# EAGLE design Syno_Ver1.1 (EAGLE 9.5.2)
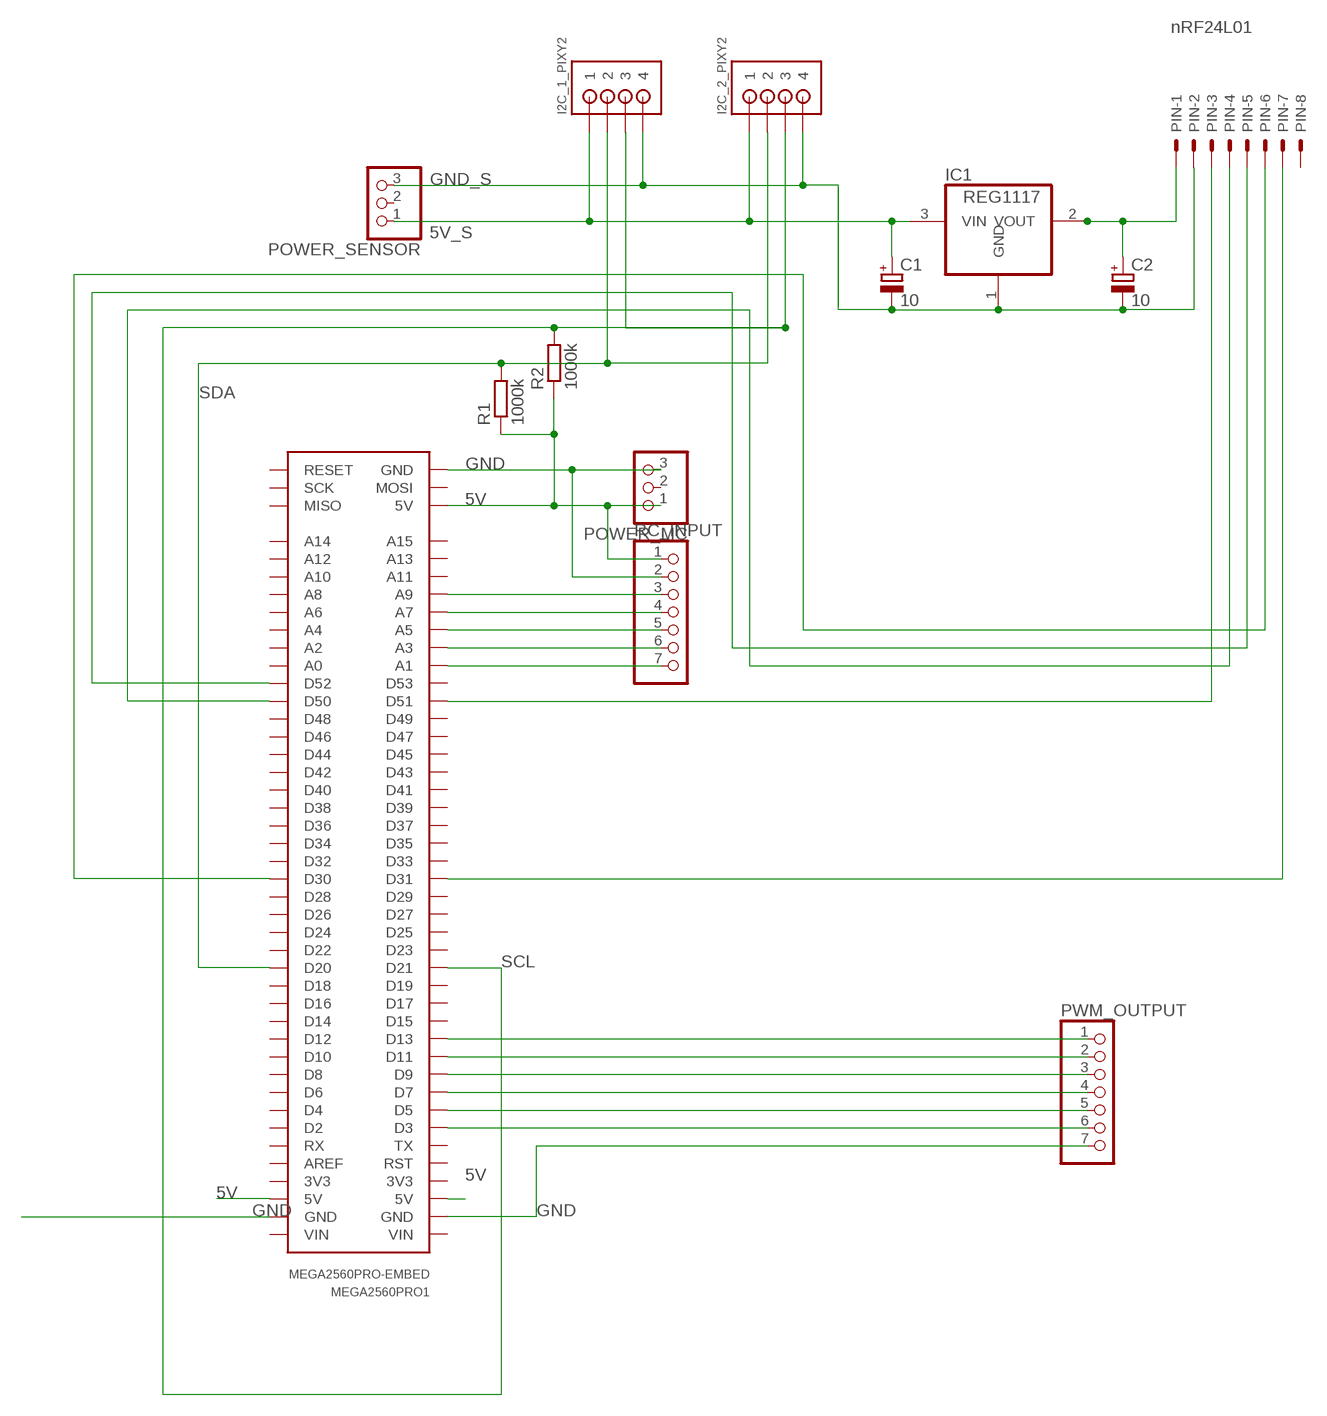
[diagram p0: schematic, sheet 1]

## Parts
C1  10  CPOL-EUE1.8-4  [E1,8-4]
C2  10  CPOL-EUE1.8-4  [E1,8-4]
I2C_1_PIXY2  JST-PH_4-PIN_HEADER  [JST_B4B-PH_HEADER]
I2C_2_PIXY2  JST-PH_4-PIN_HEADER  [JST_B4B-PH_HEADER]
IC1  REG1117  [SOT223]
MEGA2560PRO1  MEGA2560PRO-EMBED  [MEGA2560PRO-EMBED]
PIN  nRF24L01  JST-XH-08-PIN-ROUND-PAD  [JST-XH-08-PACKAGE-ROUND-PAD]
POWER_MC  PINHD-1X3/90  [1X03/90]
POWER_SENSOR  PINHD-1X3/90  [1X03/90]
PWM_OUTPUT  PINHD-1X7/90  [1X07/90]
R1  1000k  R-EU_0204/5  [0204/5]
R2  1000k  R-EU_0204/5  [0204/5]
RC_INPUT  PINHD-1X7/90  [1X07/90]

## Nets
5V: MEGA2560PRO1.5V@1(5V) MEGA2560PRO1.5V@2(5V) MEGA2560PRO1.5V@3(5V) POWER_MC.1 R1.1 R2.1 RC_INPUT.1
5V_S: C1.+ I2C_1_PIXY2.P1 I2C_2_PIXY2.P1 IC1.3(VIN) POWER_SENSOR.1
GND: MEGA2560PRO1.GND@1(GND) MEGA2560PRO1.GND@2(GND) MEGA2560PRO1.GND@3(GND) POWER_MC.3 PWM_OUTPUT.7 RC_INPUT.2
GND_S: C1.- C2.- I2C_1_PIXY2.P4 I2C_2_PIXY2.P4 IC1.1(GND) PIN.2 POWER_SENSOR.3
N$1: MEGA2560PRO1.D51 PIN.3
N$2: C2.+ IC1.2(VOUT) PIN.1
N$3: MEGA2560PRO1.D50 PIN.4
N$4: MEGA2560PRO1.D52 PIN.5
N$5: MEGA2560PRO1.D30 PIN.6
N$6: MEGA2560PRO1.D31 PIN.7
N$7: MEGA2560PRO1.D13 PWM_OUTPUT.1
N$8: MEGA2560PRO1.D11 PWM_OUTPUT.2
N$9: MEGA2560PRO1.D9 PWM_OUTPUT.3
N$10: MEGA2560PRO1.D7 PWM_OUTPUT.4
N$11: MEGA2560PRO1.D5 PWM_OUTPUT.5
N$12: MEGA2560PRO1.D3 PWM_OUTPUT.6
N$13: MEGA2560PRO1.A9 RC_INPUT.3
N$14: MEGA2560PRO1.A7 RC_INPUT.4
N$15: MEGA2560PRO1.A5 RC_INPUT.5
N$16: MEGA2560PRO1.A3 RC_INPUT.6
N$17: MEGA2560PRO1.A1 RC_INPUT.7
SCL: I2C_1_PIXY2.P3 I2C_2_PIXY2.P3 MEGA2560PRO1.D21 R2.2
SDA: I2C_1_PIXY2.P2 I2C_2_PIXY2.P2 MEGA2560PRO1.D20 R1.2
Unconnected: MEGA2560PRO1.3V3@1(3V3) MEGA2560PRO1.3V3@2(3V3) MEGA2560PRO1.A0 MEGA2560PRO1.A2 MEGA2560PRO1.A4 MEGA2560PRO1.A6 MEGA2560PRO1.A8 MEGA2560PRO1.A10 MEGA2560PRO1.A11 MEGA2560PRO1.A12 MEGA2560PRO1.A13 MEGA2560PRO1.A14 MEGA2560PRO1.A15 MEGA2560PRO1.AREF MEGA2560PRO1.D2 MEGA2560PRO1.D4 MEGA2560PRO1.D6 MEGA2560PRO1.D8 MEGA2560PRO1.D10 MEGA2560PRO1.D12 MEGA2560PRO1.D14 MEGA2560PRO1.D15 MEGA2560PRO1.D16 MEGA2560PRO1.D17 MEGA2560PRO1.D18 MEGA2560PRO1.D19 MEGA2560PRO1.D22 MEGA2560PRO1.D23 MEGA2560PRO1.D24 MEGA2560PRO1.D25 MEGA2560PRO1.D26 MEGA2560PRO1.D27 MEGA2560PRO1.D28 MEGA2560PRO1.D29 MEGA2560PRO1.D32 MEGA2560PRO1.D33 MEGA2560PRO1.D34 MEGA2560PRO1.D35 MEGA2560PRO1.D36 MEGA2560PRO1.D37 MEGA2560PRO1.D38 MEGA2560PRO1.D39 MEGA2560PRO1.D40 MEGA2560PRO1.D41 MEGA2560PRO1.D42 MEGA2560PRO1.D43 MEGA2560PRO1.D44 MEGA2560PRO1.D45 MEGA2560PRO1.D46 MEGA2560PRO1.D47 MEGA2560PRO1.D48 MEGA2560PRO1.D49 MEGA2560PRO1.D53 MEGA2560PRO1.MISO MEGA2560PRO1.MOSI MEGA2560PRO1.RESET MEGA2560PRO1.RST MEGA2560PRO1.RX MEGA2560PRO1.SCK MEGA2560PRO1.TX MEGA2560PRO1.VIN@1(VIN) MEGA2560PRO1.VIN@2(VIN) PIN.8 POWER_MC.2 POWER_SENSOR.2

## Library data of the parts
C1 C2 = rcl:CPOL-EU: POLARIZED CAPACITOR, European symbol; SPICEPREFIX: C
I2C_1_PIXY2 I2C_2_PIXY2 = srg:JST-PH_4-PIN_HEADER: 4-pin JST PH Shrouded Header, top entry P/N B4B-PH-K-S Mating connector PHR-4 Mating cable assembly: Sparkfun PRT-09916 <http://www.sparkfun.com/products/9916>
IC1 = burr-brown:REG1117: 800mA and 1A Low Dropout (LDO) Positive Regulator 1.8V, 2.5V, 2.85V, 3.3V, 5V, and Adj; MPN: REG1117; OC_FARNELL: 1097566; OC_NEWARK: 14P6981
MEGA2560PRO1 = robotdyn:MEGA2560PRO-EMBED: Robotdyn Robotdyn Mega 2560 PRO (Embed) https://robotdyn.com/mega-2560-pro-embed-ch340g-atmega2560-16au.html
PIN = Rembrandt Electronics - JST XH Connectors v1-0:JST-XH-08-PIN: JST XH Connector 2 Pin Wire to board connector. Pitch: 2,54 mm, (0.100") Number of pins: 8 Created by Rembrandt Electronics www.rembrandtelectronics.com
POWER_MC POWER_SENSOR = pinhead:PINHD-1X3: PIN HEADER
PWM_OUTPUT RC_INPUT = pinhead:PINHD-1X7: PIN HEADER
R1 R2 = rcl:R-EU_: RESISTOR, European symbol; SPICEPREFIX: R

## Board
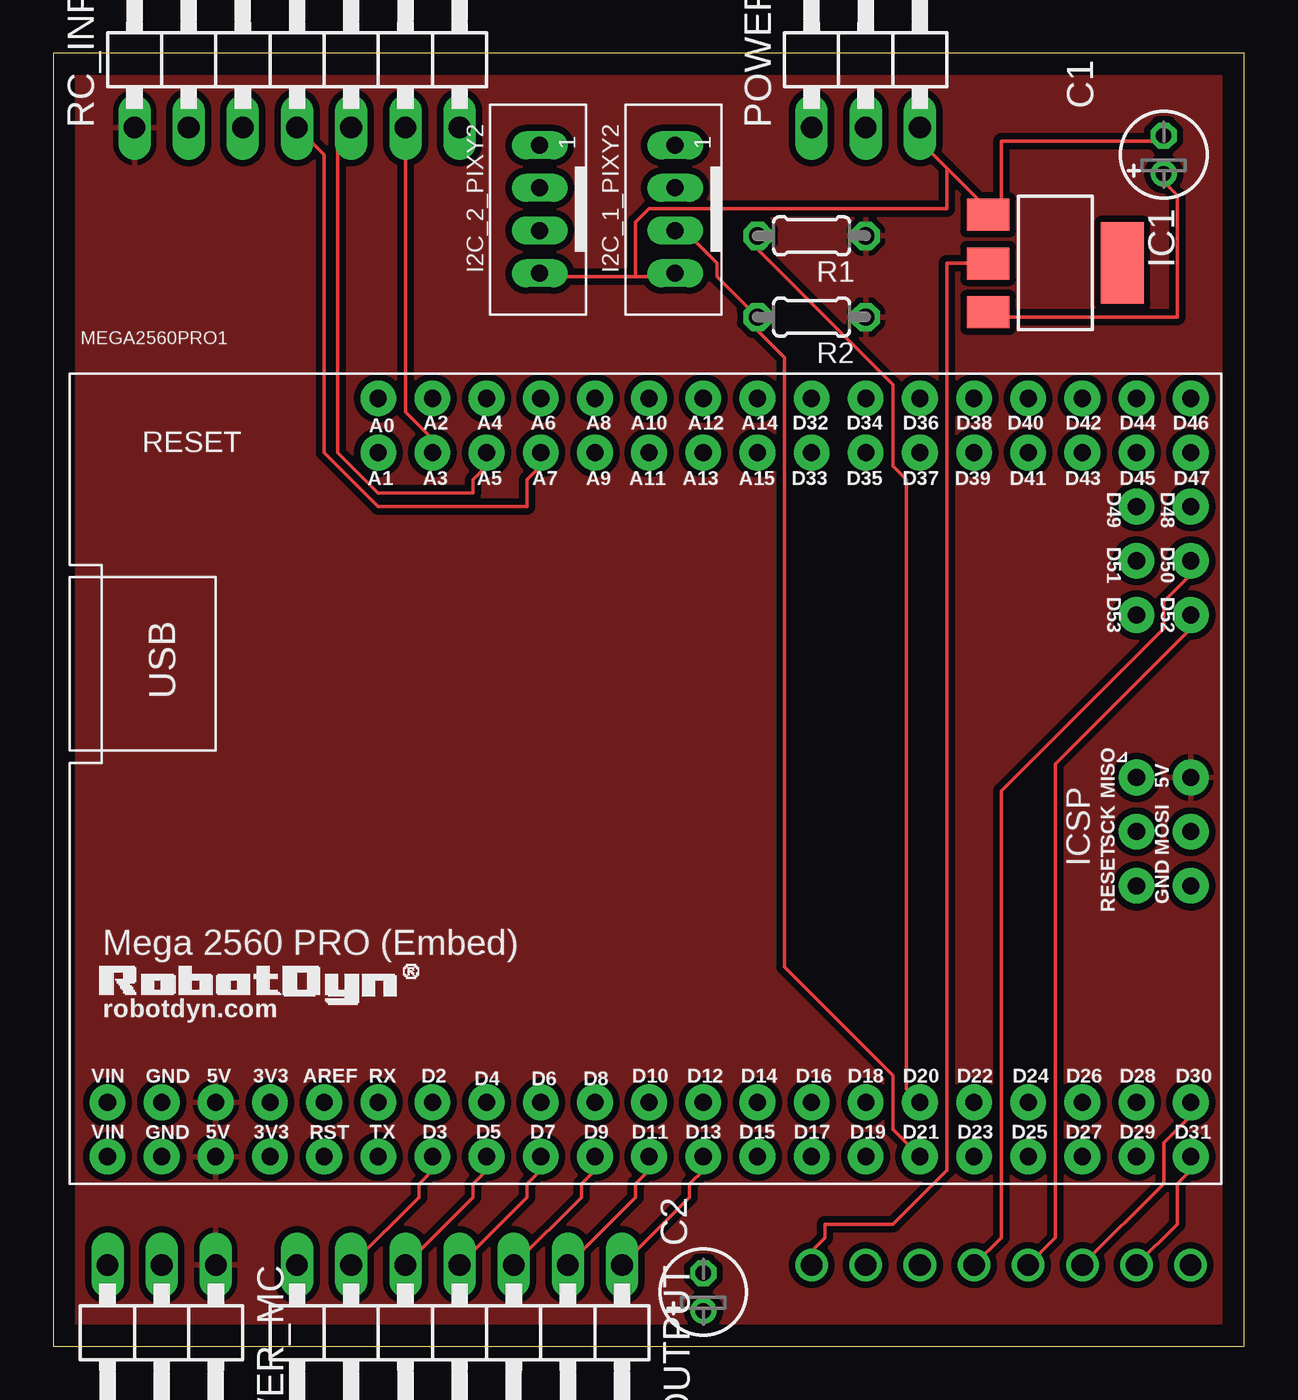
[diagram p1: board, top side]
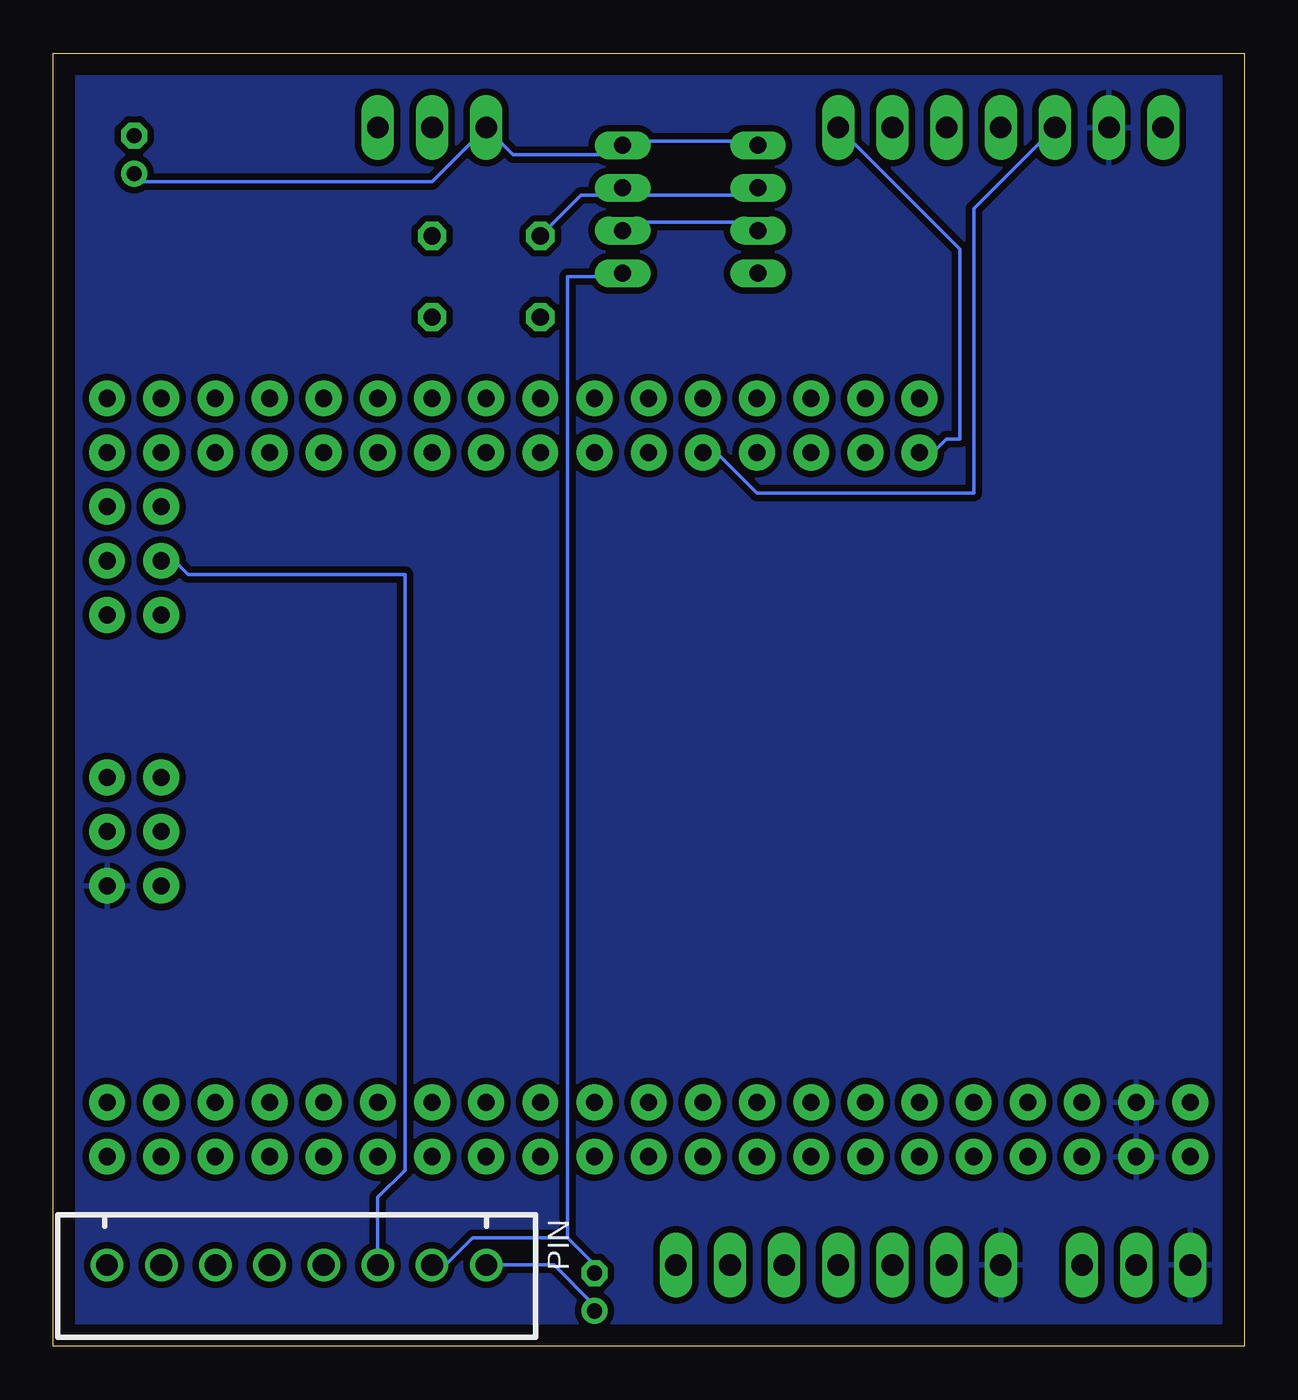
[diagram p2: board, bottom side, seen from below]

Size 55.86 x 60.63 mm. Coordinates in mm from the lower left corner, seen from the top.
Outline: 0,0 55.86,0 55.86,60.63 0,60.63 0,0
Copper layers (1*16): Top 0.035mm / dielectric 1.5mm / Bottom 0.035mm
Design rules "default": minimum track width 6mil, minimum drill 0.35mm, track to track 6mil, track to pad 6mil, pad to pad 6mil, via to via 6mil, smd to smd 6mil, copper to edge 40mil, drill to drill 6mil, minimum pad ring 10mil, minimum via ring 8mil, stop-mask expansion 4mil, vias tented up to drill 0mil, thermal gap 10mil

### Footprints (pad centres in the part's own frame; a part is rotated, then mirrored left to right if it is on the bottom)
E1,8-4 = drill 0.711 pad 1.168: + -0.889,0 | drill 0.711 pad 1.168 octagon: - 0.889,0
JST_B4B-PH_HEADER = drill 0.8 long: P1 2.98,0.048; P2 0.98,0.048; P3 -1.02,0.048; P4 -3.02,0.048
SOT223 = smd 1.499 x 2.007: 1 -2.261,-3.15; 2 0.025,-3.15; 3 2.311,-3.15 | smd 3.81 x 2.007: 4 0,3.15
MEGA2560PRO-EMBED = drill 0.8 pad 1.676: 3V3@1 -25.4,-19.05; 3V3@2 -25.4,-16.51; 5V@1 -27.94,-19.05; 5V@2 -27.94,-16.51; 5V@3 17.78,-1.27; A0 -20.32,16.51; A1 -20.32,13.97; A2 -17.78,16.51; A3 -17.78,13.97; A4 -15.24,16.51; A5 -15.24,13.97; A6 -12.7,16.51; A7 -12.7,13.97; A8 -10.16,16.51; A9 -10.16,13.97; A10 -7.62,16.51; A11 -7.62,13.97; A12 -5.08,16.51; A13 -5.08,13.97; A14 -2.54,16.51; A15 -2.54,13.97; AREF -22.86,-16.51; D2 -17.78,-16.51; D3 -17.78,-19.05; D4 -15.24,-16.51; D5 -15.24,-19.05; D6 -12.7,-16.51; D7 -12.7,-19.05; D8 -10.16,-16.51; D9 -10.16,-19.05; D10 -7.62,-16.51; D11 -7.62,-19.05; D12 -5.08,-16.51; D13 -5.08,-19.05; D14 -2.54,-16.51; D15 -2.54,-19.05; D16 0,-16.51; D17 0,-19.05; D18 2.54,-16.51; D19 2.54,-19.05; D20 5.08,-16.51; D21 5.08,-19.05; D22 7.62,-16.51; D23 7.62,-19.05; D24 10.16,-16.51; D25 10.16,-19.05; D26 12.7,-16.51; D27 12.7,-19.05; D28 15.24,-16.51; D29 15.24,-19.05; D30 17.78,-16.51; D31 17.78,-19.05; D32 0,16.51; D33 0,13.97; D34 2.54,16.51; D35 2.54,13.97; D36 5.08,16.51; D37 5.08,13.97; D38 7.62,16.51; D39 7.62,13.97; D40 10.16,16.51; D41 10.16,13.97; D42 12.7,16.51; D43 12.7,13.97; D44 15.24,16.51; D45 15.24,13.97; D46 17.78,16.51; D47 17.78,13.97; D48 17.78,11.43; D49 15.24,11.43; D50 17.78,8.89; D51 15.24,8.89; D52 17.78,6.35; D53 15.24,6.35; GND@1 -30.48,-19.05; GND@2 -30.48,-16.51; GND@3 17.78,-6.35; MISO 15.24,-1.27; MOSI 17.78,-3.81; RESET 15.24,-6.35; RST -22.86,-19.05; RX -20.32,-16.51; SCK 15.24,-3.81; TX -20.32,-19.05; VIN@1 -33.02,-19.05; VIN@2 -33.02,-16.51
JST-XH-08-PACKAGE-ROUND-PAD = drill 1.016: 1 -8.89,0; 2 -6.35,0; 3 -3.81,0; 4 -1.27,0; 5 1.27,0; 6 3.81,0; 7 6.35,0; 8 8.89,0
1X03/90 = drill 1.016 long: 1 -2.54,-3.81; 2 0,-3.81; 3 2.54,-3.81
1X07/90 = drill 1.016 long: 1 -7.62,-3.81; 2 -5.08,-3.81; 3 -2.54,-3.81; 4 0,-3.81; 5 2.54,-3.81; 6 5.08,-3.81; 7 7.62,-3.81
0204/5 = drill 0.813 octagon: 1 -2.54,0; 2 2.54,0

### Placement (x,y rotation side)
C1  52.07,55.88 90 top
C2  30.48,2.54 90 top
I2C_1_PIXY2  29.21,53.34 90 top
I2C_2_PIXY2  22.86,53.34 90 top
IC1  46.99,50.8 270 top
MEGA2560PRO1  35.56,27.94 0 top
PIN  44.45,3.81 180 bottom
POWER_MC  5.08,0 180 top
POWER_SENSOR  38.1,60.96 0 top
PWM_OUTPUT  19.05,0 180 top
R1  35.56,52.07 180 top
R2  35.56,48.26 180 top
RC_INPUT  11.43,60.96 0 top

### Tracks (layer width: path | path; a pad name or v marks a point on that pad's centre or on a via)
5V
  pour Top (isolate 0.305): 0,60.96 0,0 55.88,0 55.88,60.96
5V_S
  Top 0.152: IC1.3 44.45,48.26 52.7,48.26 52.7,53.98 52.07,54.61 C1.+
  Bottom 0.152: I2C_2_PIXY2.P1 22.86,56.52 28.57,56.52 I2C_1_PIXY2.P1 29.21,55.88 34.29,55.88 POWER_SENSOR.1 38.1,54.61 52.07,54.61 C1.+
GND
  pour Bottom (isolate 0.305): 0,60.96 0,0 57.15,0 57.15,60.96
GND_S
  Top 0.152: 27.3,50.16 28.57,50.16 I2C_1_PIXY2.P4 | 27.3,50.16 22.86,50.16 I2C_2_PIXY2.P4 | 41.91,55.24 40.64,56.52 POWER_SENSOR.3 | 41.91,55.24 43.81,53.34 IC1.1 44.45,53.34 44.45,56.52 52.07,56.52 C1.- | 27.3,50.16 27.3,52.7 27.94,53.34 41.91,53.34 41.91,55.24
  Bottom 0.152: 31.75,5.08 30.48,3.81 C2.- | 31.75,5.08 36.2,5.08 37.47,3.81 PIN.2 | 31.75,5.08 31.75,50.16 29.21,50.16 I2C_1_PIXY2.P4
N$1
  Bottom 0.152: PIN.3 40.64,6.99 39.37,8.26 39.37,36.2 49.53,36.2 50.16,36.83 MEGA2560PRO1.D51
N$2
  Top 0.152: PIN.1 35.56,4.45 36.2,5.08 36.2,5.71 39.37,5.71 41.91,8.26 41.91,50.8 43.81,50.8 IC1.2
  Bottom 0.152: PIN.1 32.38,3.81 30.48,1.91 C2.+
N$3
  Top 0.152: PIN.4 44.45,5.08 44.45,26.04 52.07,33.66 52.07,34.92 53.34,36.2 MEGA2560PRO1.D50
N$4
  Top 0.152: PIN.5 46.99,5.08 46.99,27.3 53.34,33.66 MEGA2560PRO1.D52
N$5
  Top 0.152: PIN.6 52.07,7.62 52.07,9.53 53.34,10.79 MEGA2560PRO1.D30
N$6
  Top 0.152: PIN.7 52.7,5.71 52.7,7.62 53.34,8.26 MEGA2560PRO1.D31
N$7
  Top 0.152: PWM_OUTPUT.1 29.84,6.99 29.84,7.62 30.48,8.26 MEGA2560PRO1.D13
N$8
  Top 0.152: PWM_OUTPUT.2 27.3,6.99 27.3,7.62 27.94,8.26 MEGA2560PRO1.D11
N$9
  Top 0.152: PWM_OUTPUT.3 24.77,6.99 24.77,7.62 25.4,8.26 MEGA2560PRO1.D9
N$10
  Top 0.152: PWM_OUTPUT.4 22.23,6.99 22.23,7.62 22.86,8.26 MEGA2560PRO1.D7
N$11
  Top 0.152: PWM_OUTPUT.5 19.68,6.99 19.68,7.62 20.32,8.26 MEGA2560PRO1.D5
N$12
  Top 0.152: PWM_OUTPUT.6 17.14,6.99 17.14,7.62 17.78,8.26 MEGA2560PRO1.D3
N$13
  Bottom 0.152: RC_INPUT.3 12.7,53.34 12.7,40.01 22.86,40.01 24.77,41.91 MEGA2560PRO1.A9
N$14
  Top 0.152: RC_INPUT.4 12.7,55.88 12.7,41.91 15.24,39.37 22.23,39.37 22.23,40.64 22.86,41.27 MEGA2560PRO1.A7
N$15
  Top 0.152: RC_INPUT.5 13.34,56.52 13.34,41.91 15.24,40.01 19.68,40.01 19.68,40.64 20.32,41.27 MEGA2560PRO1.A5
N$16
  Top 0.152: RC_INPUT.6 16.51,43.81 17.78,42.55 MEGA2560PRO1.A3
N$17
  Bottom 0.152: RC_INPUT.7 13.34,51.44 13.34,42.55 13.97,42.55 14.61,41.91 MEGA2560PRO1.A1
SCL
  Top 0.152: I2C_1_PIXY2.P3 29.21,52.7 31.11,50.8 31.11,50.16 R2.2 33.02,47.62 34.29,46.35 34.29,17.78 39.37,12.7 39.37,10.16 MEGA2560PRO1.D21
  Bottom 0.152: I2C_2_PIXY2.P3 22.86,52.7 28.57,52.7 I2C_1_PIXY2.P3
SDA
  Top 0.152: MEGA2560PRO1.D20 40.01,12.06 40.01,40.64 39.37,41.27 39.37,45.09 33.02,51.44 R1.2
  Bottom 0.152: I2C_2_PIXY2.P2 22.86,53.98 28.57,53.98 I2C_1_PIXY2.P2 29.21,53.98 31.11,53.98 R1.2